# Altium project Power Board UCC28951.PrjPcb (part 3 of 4)

## Sheet Input Sense Network.SchDoc
size A4
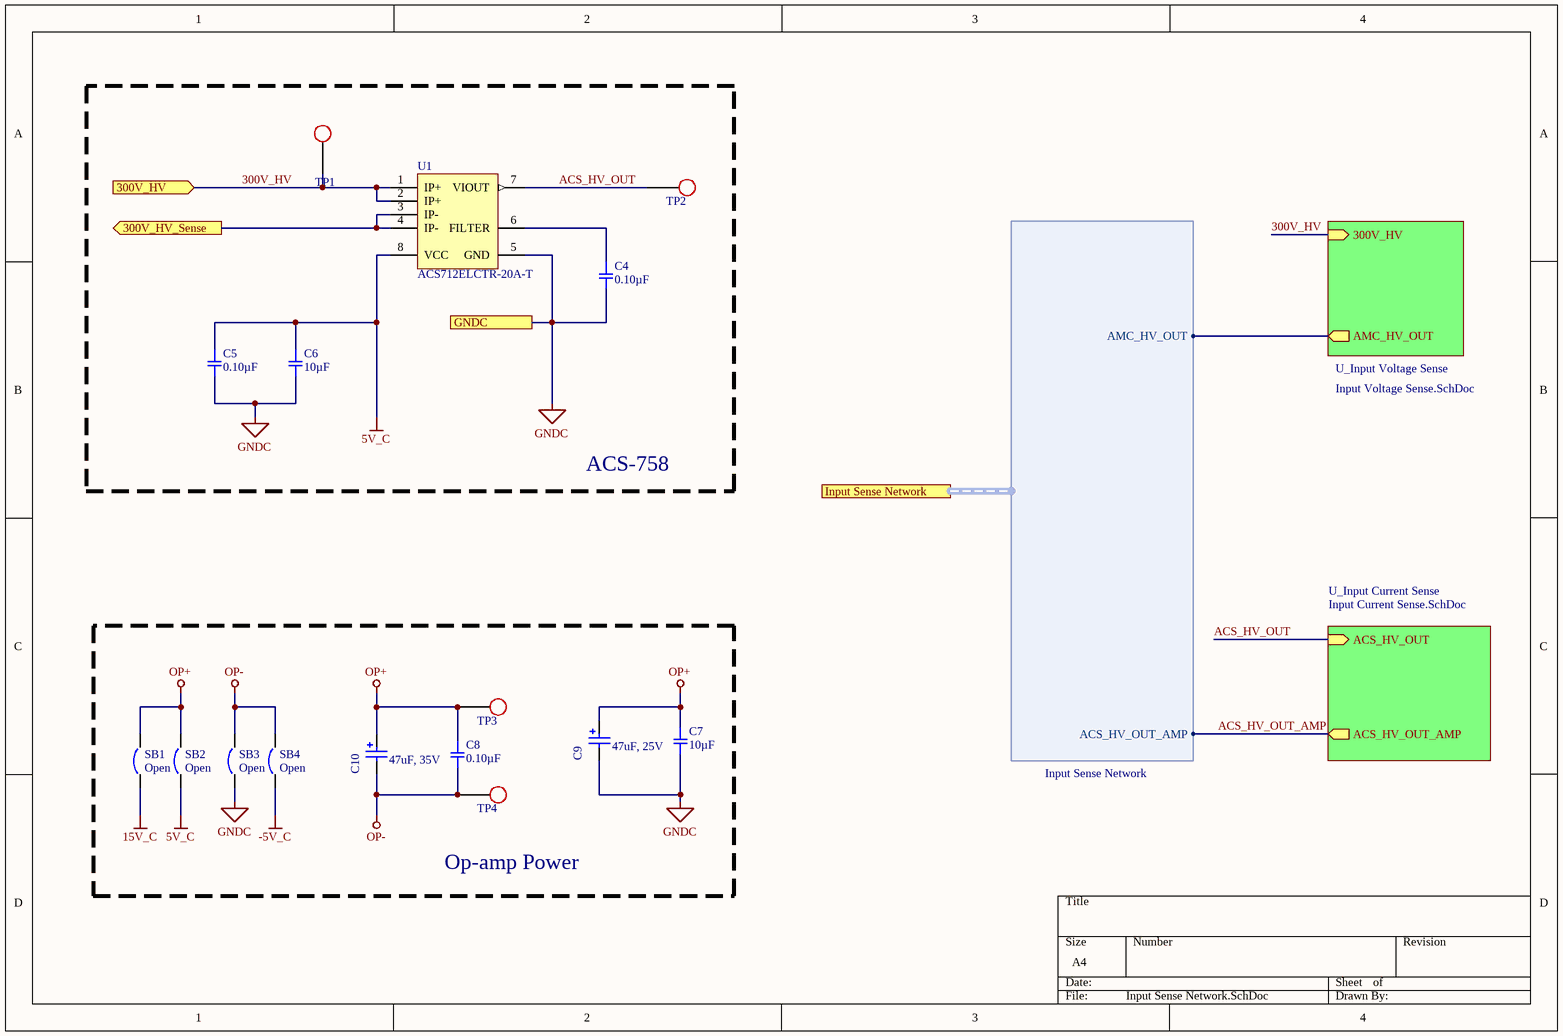
[diagram p12: Input Sense Network.SchDoc]

### Parts
C4  0.10µF  [SMD-0805C]
C5  0.10µF  [SMD-0805C]
C6  10µF  [SMD-0805C]
C7  10µF  [SMD-0805C]
C8  0.10µF  [SMD-0805C]
C9  47uF, 25V  [WCAP-ASLU_6.3x7.7]
C10  47uF, 35V  [WCAP-ASLL_6.3x5.5]
SB1  Open  [0805-Solder Bridge]  (no BOM)
SB2  Open  [0805-Solder Bridge]  (no BOM)
SB3  Open  [0805-Solder Bridge]  (no BOM)
SB4  Open  [0805-Solder Bridge]  (no BOM)
TP1  Test Point  [Test_point_THT]  (value not drawn)  (no BOM)
TP2  Test Point  [Test_point_THT]  (value not drawn)  (no BOM)
TP3  Test Point  [Test_point_THT]  (value not drawn)  (no BOM)
TP4  Test Point  [Test_point_THT]  (value not drawn)  (no BOM)
U1  ACS712ELCTR-20A-T  [SOIC127P570X175_HS-9N]

### Blocks framed on the sheet
ACS-758: C4-C6 TP1 TP2 U1
Op-amp Power: C7-C10 SB1-SB4 TP3 TP4

### Sub-sheets
U_Input Current Sense = Input Current Sense.SchDoc: ACS_HV_OUT (in), ACS_HV_OUT_AMP (out)
U_Input Voltage Sense = Input Voltage Sense.SchDoc: 300V_HV (in), AMC_HV_OUT (out)

### Ports
300V_HV (in), 300V_HV_Sense (out), GNDC, Input Sense Network (harness Input Sense Network)

### Harnesses
Input Sense Network: ACS_HV_OUT_AMP, AMC_HV_OUT

### Nets
5V_C: C5.1 C6.1 SB2.1 U1.8(VCC)
15V_C: SB1.1
-5V_C: SB4.1
GNDC: C4.2 C5.2 C6.2 C7.2 C9.1(N) SB3.1 U1.5(GND) ; port GNDC  [project net GND_LV]
OP+: C7.1 C8.1 C9.2(P) C10.2(P) SB1.2 SB2.2 TP3.1
OP-: C8.2 C10.1(N) SB3.2 SB4.2 TP4.1
300V_HV: TP1.1 U1.1(IP+) U1.2(IP+) ; port 300V_HV, sheet U_Input Voltage Sense/300V_HV
300V_HV_Sense: U1.3(IP-) U1.4(IP-) ; port 300V_HV_Sense
ACS_HV_OUT: TP2.1 U1.7(VIOUT) ; sheet U_Input Current Sense/ACS_HV_OUT
ACS_HV_OUT_AMP: sheet U_Input Current Sense/ACS_HV_OUT_AMP, port Input Sense Network.ACS_HV_OUT_AMP
AMC_HV_OUT: sheet U_Input Voltage Sense/AMC_HV_OUT, port Input Sense Network.AMC_HV_OUT
NetC4_1: C4.1 U1.6(FILTER)

### Library data of the parts
C4 C5 C8 = GCD21BR71H104KA01L: CAP CER 0.1UF 50V X7R 0805; Manufacturer: Murata Electronics North America; Factory Stock: 0; Unit Price (USD): 0.24; Minimum Quantity: 1; Tolerance: ±10%; Datasheets: http://www.murata.com/~/media/webrenewal/support/library/catalog/products/capacitor/mlcc/c03e.ashx; Image: //media.digikey.com/Renders/Murata%20Renders/0805%28GxM6%29.jpg; Digi-Key Part Number: 490-11955-1-ND; Part Number: GCD21BR71H104KA01L; Quantity Available: 157; @ qty: 0; Packaging: Cut Tape (CT); Series: GCD; Part Status: Active; Value: 0.10µF; Voltage: 50V; Temperature Coefficient: X7R; Operating Temperature: -55°C ~ 125°C; Features: -; Ratings: AEC-Q200; Applications: Automotive; Mounting Type: Surface Mount, MLCC; Package / Case: 0805 (2012 Metric); Size / Dimension: 0.079" L x 0.049" W (2.00mm x 1.25mm); Height - Seated (Max): -; Thickness (Max): 0.049" (1.25mm); Lead Spacing: -; Lead Style: -
C6 C7 = GCJ21BR71A106KE01L: CAP CER 10UF 10V X7R 0805; Manufacturer: Murata Electronics North America; Factory Stock: 0; Unit Price (USD): 0.56; Minimum Quantity: 1; Tolerance: ±10%; Datasheets: http://www.murata.com/~/media/webrenewal/support/library/catalog/products/capacitor/mlcc/c03e.ashx; Image: //media.digikey.com/Renders/Murata%20Renders/0805%20(2012%20Metric)%20.85mm.jpg; Digi-Key Part Number: 490-12646-1-ND; Part Number: GCJ21BR71A106KE01L; Quantity Available: 2702; @ qty: 0; Packaging: Cut Tape (CT); Series: GCJ; Part Status: Active; Value: 10µF; Voltage: 10V; Temperature Coefficient: X7R; Operating Temperature: -55°C ~ 125°C; Features: Soft Termination; Ratings: AEC-Q200; Applications: Automotive, Boardflex Sensitive; Mounting Type: Surface Mount, MLCC; Package / Case: 0805 (2012 Metric); Size / Dimension: 0.079" L x 0.049" W (2.00mm x 1.25mm); Height - Seated (Max): -; Thickness (Max): 0.057" (1.45mm); Lead Spacing: -; Lead Style: -
C9 = 865090445006: WCAP-ASLU Aluminium Electrolytic Capacitors, D6.3mm x L7.7mm, 47uF, +/-20%, 25VDC; Dissipation Factor: 16%; Leakage Current: 2.35uA; Endurance: 1000h; Technical Reference: ASBD077470M025DVCTCA000; Ripple Current max.: 65mA; ComponentLink1Description: Manufacturer; ComponentLink1URL: http://www.we-online.de; ComponentLink2Description: Datasheet; ComponentLink2URL: https://katalog.we-online.com/pbs/datasheet/865090445006.pdf; Mounting Technology: SMD; Operating Temperature: -40 to +85degC; Packaging: Tape and Reel; Part Number: 865090445006; Publisher: Wurth Elektronik; Capacitance: 47uF; Diameter: 6.3mm; Length: 7.7mm; Published Date: August 2019; Rated Voltage: 25VDC; Capacitance Tolerance: +/-20%
C10 = 865060543005: WCAP-ASLL SMT Aluminum Electrolytic Capacitors, D6.3mm x L5.5mm, 47uF, +/-20%, 35VDC; Dissipation Factor: 14%; Endurance: 2000h; Leakage Current: 16.45uA; Ripple Current max.: 240mA; Technical Reference: ASED055470M035DVCTBB000; ComponentLink1Description: Manufacturer; ComponentLink1URL: http://www.we-online.de; ComponentLink2Description: Datasheet; ComponentLink2URL: https://katalog.we-online.com/pbs/datasheet/865060543005.pdf; Length: 5.5mm; Mounting Technology: SMT; Operating Temperature: -55 to +105degC; Packaging: Tape and Reel; Published Date: August 2019; Capacitance: 47uF; Diameter: 6.3mm; Part Number: 865060543005; Publisher: Wurth Elektronik; Capacitance Tolerance: +/-20%; Rated Voltage: 35VDC
SB1-SB4 = Solder Bridge: Circuit Breaker; Published: 24-Mar-1999; Revision: July-2002: Re-released for DXP Platform.; Publisher: Altium Limited
TP1-TP4 = Test Point: TP
U1 = ACS712: Linear Current Sensor IC, 4.5 to 5.5 V Supply Voltage, 10 mA Supply Current, -40 to 85 degC, 8-Pin SOIC (LC), RoHS, Tape and Reel; Manufacturer: Allegro Microsystems; CLOAD: 10 nF Max.; ICC: 10 mA; F: 80 kHz; RLOAD: 4.7 kOhm Min.; Optimized Accuracy Range: +/- 20 A; TR: 3.5 us; Sensitivity Sens: 100 mV/A Typ.; Operating Temperature Range: -40 to 85 degC; ComponentLink2URL: http://www.allegromicro.com/~/media/Files/Datasheets/ACS712-Datasheet.ashx; ComponentLink1Description: Manufacturer URL; VCC: 4.5 to 5.5 V; Mounting Technology: Surface Mount; DatasheetVersion: Rev. 15; ComponentLink2Description: Datasheet; ComponentLink1URL: http://www.allegromicro.com/; PackageDescription: 8-Pin SOIC, Body 4.9 x 3.9 mm, Pitch 1.27 mm; PackageReference: LC-8; RoHS: TRUE; Packing: Tape and Reel; PartNumber: ACS712ELCTR-20A-T

## Sheet Input Current Sense.SchDoc
size A3
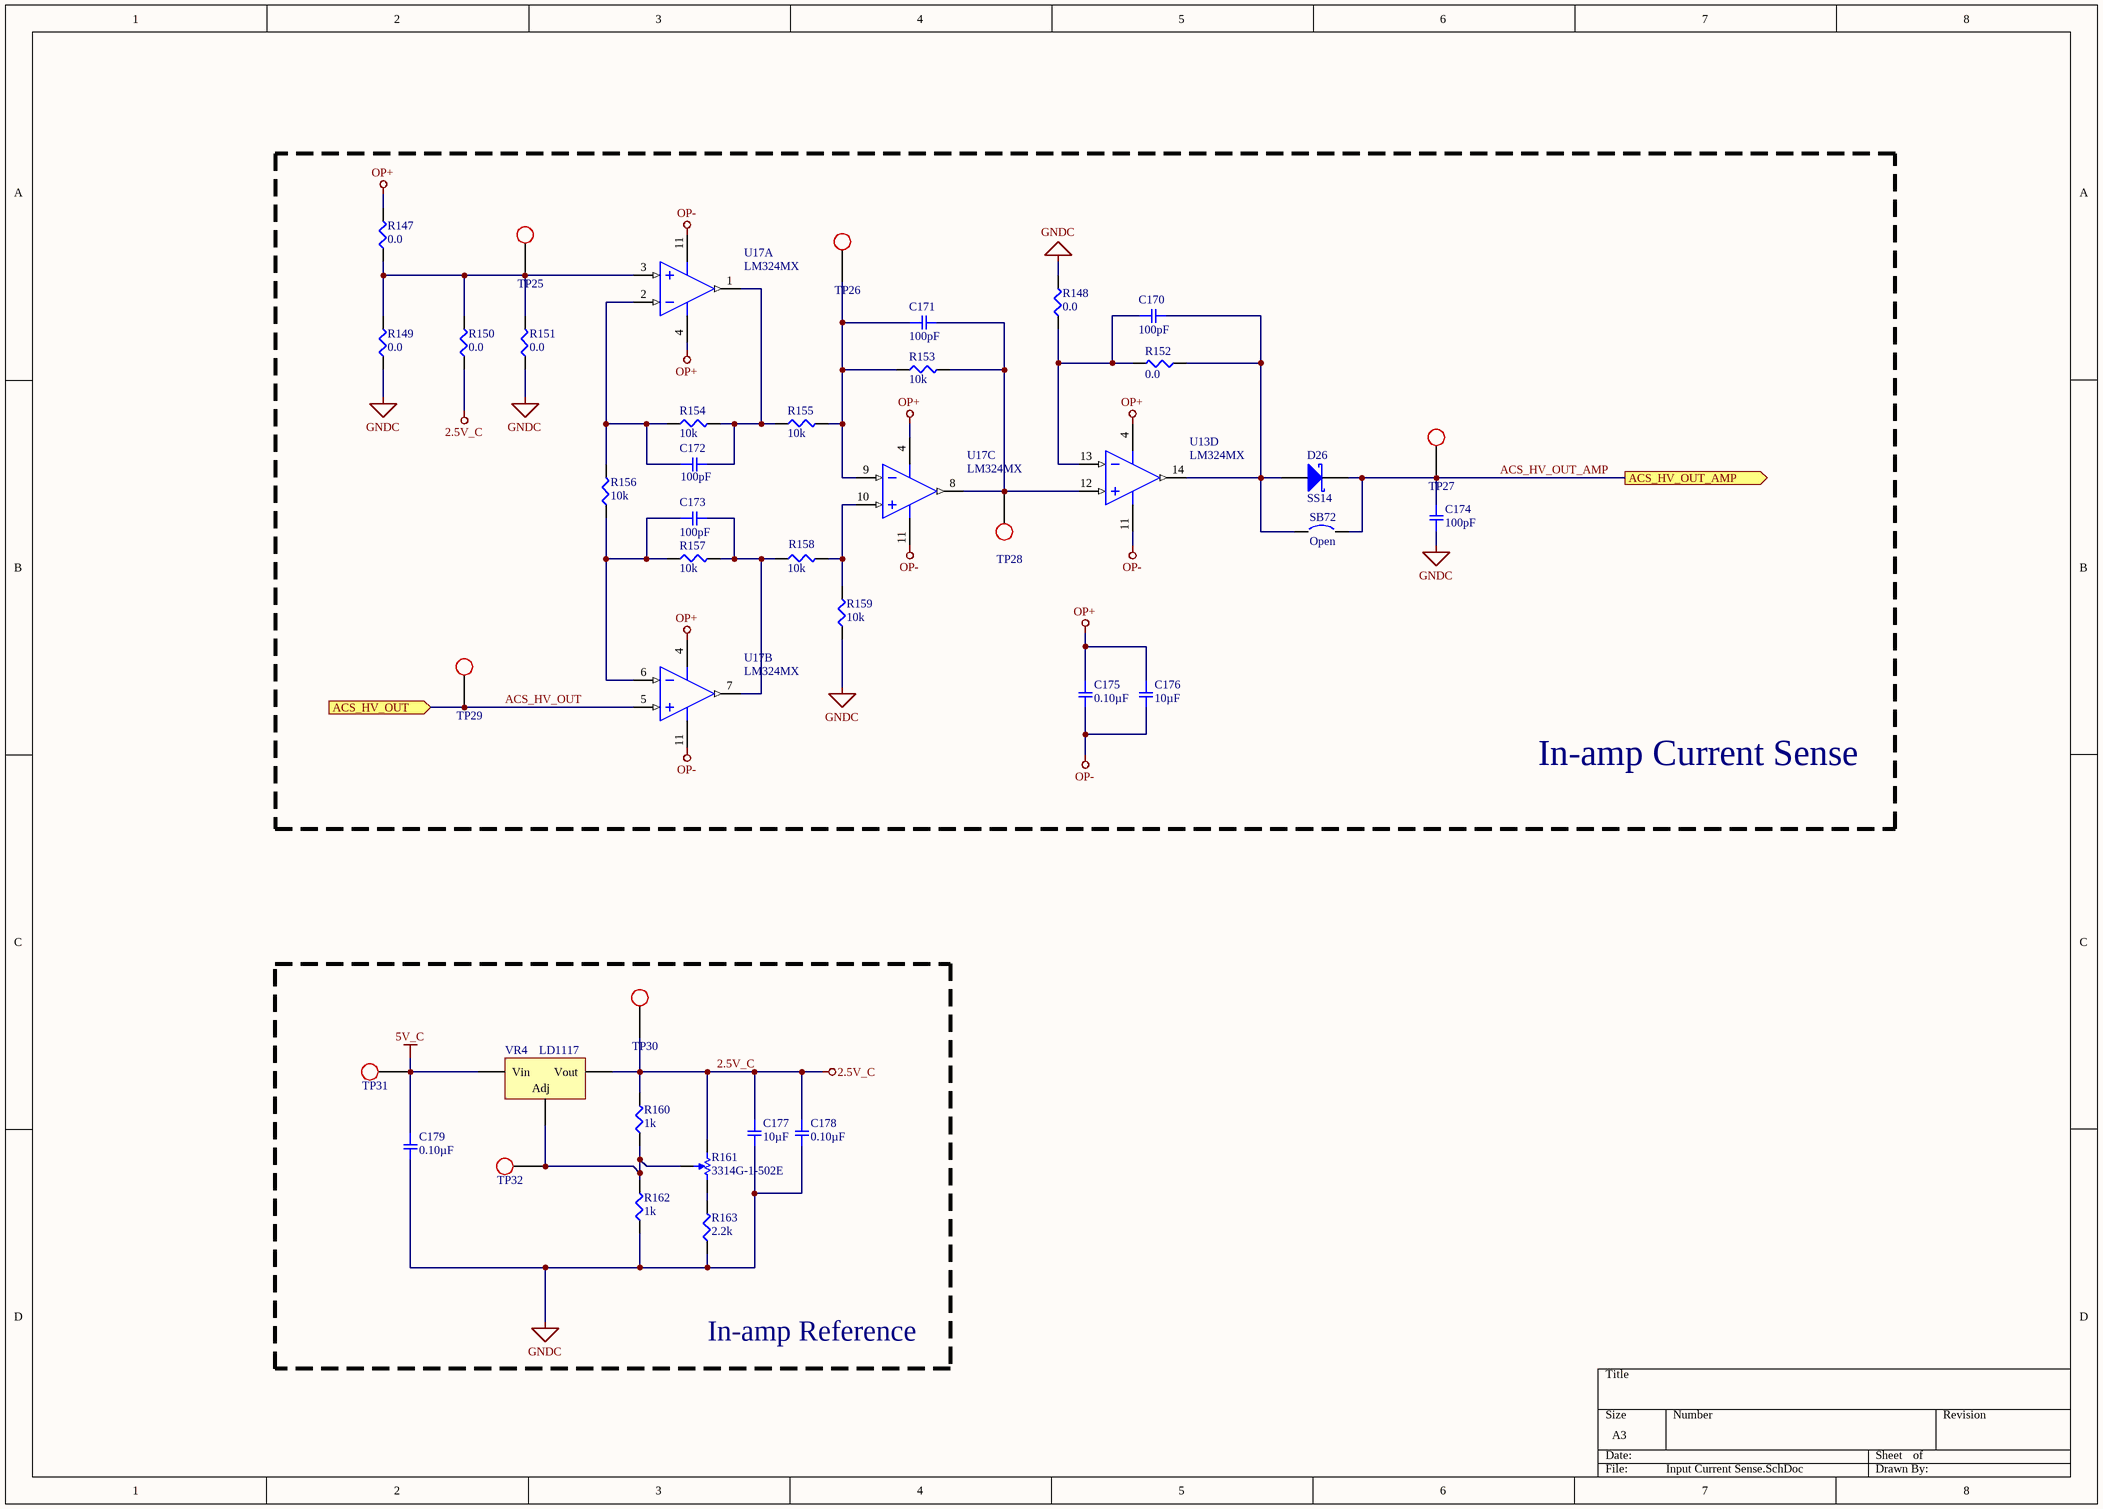
[diagram p13: Input Current Sense.SchDoc]

### Parts
(Parts that share a designator on the sheet are numbered #1, #2 ... from top to bottom, then left to right.)
C170#2  100pF  [SMD-0603C]
C171#2  100pF  [SMD-0603C]
C172#2  100pF  [SMD-0603C]
C173#2  100pF  [SMD-0603C]
C174#2  100pF  [SMD-0603C]
C175#1  0.10µF  [SMD-0805C]
C176#1  10µF  [SMD-0805C]
C177#1  10µF  [SMD-0805C]
C178#1  0.10µF  [SMD-0805C]
C179#1  0.10µF  [SMD-0805C]
D26#1  SS14  [DIOM4226X22N]
R147  0.0  [SMD-0603-RES]
R148  0.0  [SMD-0603-RES]
R149  0.0  [SMD-0603-RES]
R150  0.0  [SMD-0603-RES]
R151  0.0  [SMD-0603-RES]
R152  0.0  [SMD-0603-RES]
R153  10k  [SMD-0603-RES]
R154  10k  [SMD-0603-RES]
R155  10k  [SMD-0603-RES]
R156#2  10k  [SMD-0603-RES]
R157#2  10k  [SMD-0603-RES]
R158#2  10k  [SMD-0603-RES]
R159#2  10k  [SMD-0603-RES]
R160#2  1k  [SMD-0603-RES]
R161#2  3314G-1-502E  [BOUR-3314G-1_V]
R162#2  1k  [SMD-0603-RES]
R163#2  2.2k  [SMD-0603-RES]
SB72  Open  [0805-Solder Bridge]  (no BOM)
TP25  Test Point  [Test_point_THT]  (value not drawn)  (no BOM)
TP26  Test Point  [Test_point_THT]  (value not drawn)  (no BOM)
TP27  Test Point  [Test_point_THT]  (value not drawn)  (no BOM)
TP28  Test Point  [Test_point_THT]  (value not drawn)  (no BOM)
TP29  Test Point  [Test_point_THT]  (value not drawn)  (no BOM)
TP30  Test Point  [Test_point_THT]  (value not drawn)  (no BOM)
TP31  Test Point  [Test_point_THT]  (value not drawn)  (no BOM)
TP32  Test Point  [Test_point_THT]  (value not drawn)  (no BOM)
U13  LM324MX  [D0014A_L]  (part D of 4)
U17#1  LM324MX  [D0014A_L]  (parts A,B,C of 4)
VR4  LD1117  [SOT230P700X180-4N]

### Blocks framed on the sheet
In-amp Current Sense: C170#2 C171#2 C172#2 C173#2 C174#2 C175#1 C176#1 D26#1 R147-R155 R156#2 R157#2 R158#2 R159#2 SB72 TP25-TP29 U13 U17#1
In-amp Reference: C177#1 C178#1 C179#1 R160#2 R161#2 R162#2 R163#2 TP30-TP32 VR4

### Ports
ACS_HV_OUT (in), ACS_HV_OUT_AMP (out)

### Nets
2.5V_C: C177#1.1 C178#1.1 R150.1 R160#2.2 R161#2.1 TP30.1 VR4.2(Vout)
5V_C: C179#1.1 TP31.1 VR4.3(Vin)
GNDC: C174#2.1 C177#1.2 C178#1.2 C179#1.2 R148.2 R149.1 R151.1 R159#2.1 R162#2.1 R163#2.1  [project net GND_LV]
OP+: C175#1.1 C176#1.1 R147.2 U13.4(V+) U17#1.4(V+)
OP-: C175#1.2 C176#1.2 U13.11(GND) U17#1.11(GND)
ACS_HV_OUT: TP29.1 U17#1.5(IN2+) ; port ACS_HV_OUT
ACS_HV_OUT_AMP: C174#2.2 D26#1.1(K) SB72.2 TP27.1 ; port ACS_HV_OUT_AMP
NetC170#2_1: C170#2.1 R148.1 R152.2 U13.13(IN4-)
NetC170#2_2: C170#2.2 D26#1.2(A) R152.1 SB72.1 U13.14(OUT4)
NetC171#2_1: C171#2.1 R153.1 R155.2 TP26.1 U17#1.9(IN3-)
NetC171#2_2: C171#2.2 R153.2 TP28.1 U13.12(IN4+) U17#1.8(OUT3)
NetC172#2_1: C172#2.1 R154.1 R156#2.2 U17#1.2(IN1-)
NetC172#2_2: C172#2.2 R154.2 R155.1 U17#1.1(OUT1)
NetC173#2_1: C173#2.1 R156#2.1 R157#2.1 U17#1.6(IN2-)
NetC173#2_2: C173#2.2 R157#2.2 R158#2.1 U17#1.7(OUT2)
NetR147_1: R147.1 R149.2 R150.2 R151.2 TP25.1 U17#1.3(IN1+)
NetR158#2_2: R158#2.2 R159#2.2 U17#1.10(IN3+)
NetR160#2_1: R160#2.1 R161#2.2 R162#2.2 TP32.1 VR4.1(Adj)
NetR161#2_3: R161#2.3 R163#2.2

### Library data of the parts
C170#2 C171#2 C172#2 C173#2 C174#2 = GCM1885C1H101JA16D: CAP CER 100PF 50V NP0 0603; Manufacturer: Murata Electronics North America; Factory Stock: 0; Unit Price (USD): 0.1; Minimum Quantity: 1; Tolerance: ±5%; Temperature Coefficient: C0G, NP0; Datasheets: http://www.murata.com/~/media/webrenewal/support/library/catalog/products/capacitor/mlcc/c03e.ashx; Image: //media.digikey.com/Renders/Murata%20Renders/0603%28GCM188%29.jpg; Digi-Key Part Number: 490-4767-1-ND; Part Number: GCM1885C1H101JA16D; Quantity Available: 85695; @ qty: 0; Packaging: Cut Tape (CT); Series: GCM; Part Status: Active; Value: 100pF; Voltage: 50V; Operating Temperature: -55°C ~ 125°C; Features: -; Ratings: AEC-Q200; Applications: Automotive; Mounting Type: Surface Mount, MLCC; Package / Case: 0603 (1608 Metric); Size / Dimension: 0.063" L x 0.031" W (1.60mm x 0.80mm); Height - Seated (Max): -; Thickness (Max): 0.035" (0.90mm); Lead Spacing: -; Lead Style: -
C175#1 C178#1 C179#1 = GCD21BR71H104KA01L: as C4 on sheet Input Sense Network; Datasheets: http://www.murata.com/~/media/webrenewal/support/library/catalog/products/capacitor/mlcc/c03e.ashx; Image: //media.digikey.com/Renders/Murata%20Renders/0805%28GxM6%29.jpg; Digi-Key Part Number: 490-11955-1-ND; Part Number: GCD21BR71H104KA01L; Quantity Available: 157; @ qty: 0; Packaging: Cut Tape (CT); Series: GCD; Part Status: Active; Value: 0.10µF; Voltage: 50V; Temperature Coefficient: X7R; Operating Temperature: -55°C ~ 125°C; Features: -; Ratings: AEC-Q200; Applications: Automotive; Mounting Type: Surface Mount, MLCC; Package / Case: 0805 (2012 Metric); Size / Dimension: 0.079" L x 0.049" W (2.00mm x 1.25mm); Height - Seated (Max): -; Thickness (Max): 0.049" (1.25mm); Lead Spacing: -; Lead Style: -
C176#1 C177#1 = GCJ21BR71A106KE01L: as C6 on sheet Input Sense Network; Datasheets: http://www.murata.com/~/media/webrenewal/support/library/catalog/products/capacitor/mlcc/c03e.ashx; Image: //media.digikey.com/Renders/Murata%20Renders/0805%20(2012%20Metric)%20.85mm.jpg; Digi-Key Part Number: 490-12646-1-ND; Part Number: GCJ21BR71A106KE01L; Quantity Available: 2702; @ qty: 0; Packaging: Cut Tape (CT); Series: GCJ; Part Status: Active; Value: 10µF; Voltage: 10V; Temperature Coefficient: X7R; Operating Temperature: -55°C ~ 125°C; Features: Soft Termination; Ratings: AEC-Q200; Applications: Automotive, Boardflex Sensitive; Mounting Type: Surface Mount, MLCC; Package / Case: 0805 (2012 Metric); Size / Dimension: 0.079" L x 0.049" W (2.00mm x 1.25mm); Height - Seated (Max): -; Thickness (Max): 0.057" (1.45mm); Lead Spacing: -; Lead Style: -
D26#1 = SS14: Schottky Rectifier, 1.1 W, -65 to 125 degC, 2-Pin SMD, RoHS, Tape and Reel; Manufacturer: Fairchild; Configuration: SINGLE; Diode Element Material: SILICON; Power Dissipation Limit-Max (W): 1.1; Additional Feature: FREEWHEELINGDIODE; Signal Diode Type: SIGNALDIODE; Number of Elements: 1; JEDEC-95 Code: DO-214AC; Rep Pk Reverse Voltage-Max (V): 40; Package Body Material: PLASTIC/EPOXY; CAGE Code: 1HBD3,07933,59621,7D893; Peak Reflow Temperature (Cel): 260; Package Shape: RECTANGULAR; Manufacturer URL: https://www.fairchildsemi.com/; JESD-97 Code: e3; Package Reference: DO-214AC-2; RoHS Compliant: YES; Package Description: 2-Pin Surface Mount Device, Body 4.375 x 2.725 mm; Technology: SCHOTTKY; Surface Mount: YES; Datasheet URL: http://www.onlinecomponents.com/datasheet/ss14.aspx?p=11369800; Terminal Form: CBEND; Package Style: SMALLOUTLINE; Number of Terminals: 2; JESD-30 Code: R-PDSO-C2; Average Forward Current-Max (A): 1; Terminal Finish: MATTETIN; Datasheet Version: Oct-13; Terminal Position: DUAL; Package URL: https://www.fairchildsemi.com/package-drawings/DO/DO214AC.pdf; Moisture Sensitivity Level: 1; Lead Free: YES
R147-R152 = ERJ-3GEY0R00V: RES SMD 0.0OHM JUMPER 1/10W 0603; Manufacturer: Panasonic Electronic Components; Factory Stock: 0; Unit Price (USD): 0.00352; @ qty: 1500; Minimum Quantity: 1; Power (Watts): 0.1W, 1/10W; Part Number: ERJ-3GEY0R00V; Datasheets: http://industrial.panasonic.com/www-cgi/jvcr13pz.cgi?E+PZ+3+AOA0001+ERJ3GEY0R00V+7+WW; Image: //media.digikey.com/Photos/Panasonic%20Photos/MFG_ERJ-P6W%20Series.jpg; Digi-Key Part Number: P0.0GCT-ND; Quantity Available: 4813372; Packaging: Cut Tape (CT); Series: ERJ; Part Status: Active; Value: 0.0; Tolerance: Jumper; Composition: Thick Film; Features: Automotive AEC-Q200; Temperature Coefficient: -; Operating Temperature: -55°C ~ 155°C; Package / Case: 0603 (1608 Metric); Supplier Device Package: 0603; Size / Dimension: 0.063" L x 0.031" W (1.60mm x 0.80mm); Height - Seated (Max): 0.022" (0.55mm); Number of Terminations: 2; Failure Rate: -
R153-R155 R156#2 R157#2 R158#2 R159#2 = ERJ-3EKF1002V: RES SMD 10K OHM 1% 1/10W 0603; Manufacturer: Panasonic Electronic Components; Factory Stock: 0; Unit Price (USD): 0.00379; @ qty: 1500; Minimum Quantity: 1; Power (Watts): 0.1W, 1/10W; Temperature Coefficient: ±100ppm/°C; Part Number: ERJ-3EKF1002V; Datasheets: http://industrial.panasonic.com/www-cgi/jvcr13pz.cgi?E+PZ+3+AOA0002+ERJ3EKF1002V+7+WW; Image: //media.digikey.com/Photos/Panasonic%20Photos/MFG_ERJ-P6W%20Series.jpg; Digi-Key Part Number: P10.0KHCT-ND; Quantity Available: 6703141; Packaging: Cut Tape (CT); Series: ERJ; Part Status: Active; Value: 10k; Tolerance: ±1%; Composition: Thick Film; Features: Automotive AEC-Q200; Operating Temperature: -55°C ~ 155°C; Package / Case: 0603 (1608 Metric); Supplier Device Package: 0603; Size / Dimension: 0.063" L x 0.031" W (1.60mm x 0.80mm); Height - Seated (Max): 0.022" (0.55mm); Number of Terminations: 2; Failure Rate: -
R160#2 R162#2 = ERJ-3EKF1001V: RES SMD 1K OHM 1% 1/10W 0603; Manufacturer: Panasonic Electronic Components; Factory Stock: 0; Unit Price (USD): 0.00379; @ qty: 1500; Minimum Quantity: 1; Power (Watts): 0.1W, 1/10W; Temperature Coefficient: ±100ppm/°C; Part Number: ERJ-3EKF1001V; Datasheets: http://industrial.panasonic.com/www-cgi/jvcr13pz.cgi?E+PZ+3+AOA0002+ERJ3EKF1001V+7+WW; Image: //media.digikey.com/Photos/Panasonic%20Photos/MFG_ERJ-P6W%20Series.jpg; Digi-Key Part Number: P1.00KHCT-ND; Quantity Available: 5218845; Packaging: Cut Tape (CT); Series: ERJ; Part Status: Active; Value: 1k; Tolerance: ±1%; Composition: Thick Film; Features: Automotive AEC-Q200; Operating Temperature: -55°C ~ 155°C; Package / Case: 0603 (1608 Metric); Supplier Device Package: 0603; Size / Dimension: 0.063" L x 0.031" W (1.60mm x 0.80mm); Height - Seated (Max): 0.022" (0.55mm); Number of Terminations: 2; Failure Rate: -
R161#2 = CMP-2000-05589-1: 4 mm Square Trimpot(R) Trimming Potentiometer, 5 KOhm, +/- 20%, 0.25 W, -55 to 125 degC, 3-Pin SMD, RoHS, Tape and Reel; Manufacturer: Bourns; Power: 250; Angle of rotation: 240°; Dielectric strength: 500; Resistance: 5; Curve: linear; Package Description: 3-Pin Surface Mount Device, Body 4.5 x 4.5 mm, Pitch 1.15 mm; Package Reference: 3314G-1; Mounting Technology: SurfaceMount; Datasheet URL: http://www.bourns.com/docs/Product-Datasheets/3314.pdf; Datasheet Version: 05/2016; Tolerance: ±20%; Manufacturer URL: http://www.bourns.com/; Temperature range: -55...+125°C; Package: GullWing
R163#2 = ERJ-3EKF2201V: RES SMD 2.2K OHM 1% 1/10W 0603; Manufacturer: Panasonic Electronic Components; Factory Stock: 0; Unit Price (USD): 0.00379; @ qty: 1500; Minimum Quantity: 1; Power (Watts): 0.1W, 1/10W; Temperature Coefficient: ±100ppm/°C; Part Number: ERJ-3EKF2201V; Datasheets: http://industrial.panasonic.com/www-cgi/jvcr13pz.cgi?E+PZ+3+AOA0002+ERJ3EKF2201V+7+WW; Image: //media.digikey.com/Photos/Panasonic%20Photos/MFG_ERJ-P6W%20Series.jpg; Digi-Key Part Number: P2.20KHCT-ND; Quantity Available: 370956; Packaging: Cut Tape (CT); Series: ERJ; Part Status: Active; Value: 2.2k; Tolerance: ±1%; Composition: Thick Film; Features: Automotive AEC-Q200; Operating Temperature: -55°C ~ 155°C; Package / Case: 0603 (1608 Metric); Supplier Device Package: 0603; Size / Dimension: 0.063" L x 0.031" W (1.60mm x 0.80mm); Height - Seated (Max): 0.022" (0.55mm); Number of Terminations: 2; Failure Rate: -
SB72 = Solder Bridge: Circuit Breaker; Published: 24-Mar-1999; Revision: July-2002: Re-released for DXP Platform.; Publisher: Altium Limited
TP25-TP32 = Test Point: TP
U13 U17#1 = CMP-0055-00741-3: Low Power Quad Operational Amplifier, 14-pin Narrow SOIC; Manufacturer: Texas Instruments; PowerWise: N; CompType: Amplifiers; PackageTopMarking: NSUZXYTTE#*LM324M; Package Reference: D0014A; ComponentLink1URL: http://www.ti.com/general/docs/lit/getliterature.tsp?genericPartNumber=LM324-N&fileType=pdf; PinCount: 14; PackageDescription: Molded Package S.O., .150in Wide, 14 Lead; Code_JEDEC: MS-012AB; Code_IPC: SOIC127P600-14; ComponentLink1Description: Datasheet URL; RoHS: N
VR4 = LD117-Adj: Voltage Regulator; Published: 24-Mar-1999; LatestRevisionDate: 29-May-2009; LatestRevisionNote: IPC-7351 Footprint Added.; PackageReference: D2PAK; Publisher: Altium Limited; PackageDescription: 3-Pin Transistor Outline Package 2.54 mm Pitch, 15.1 mm Lead Span

## Sheet Input Voltage Sense.SchDoc
size A3
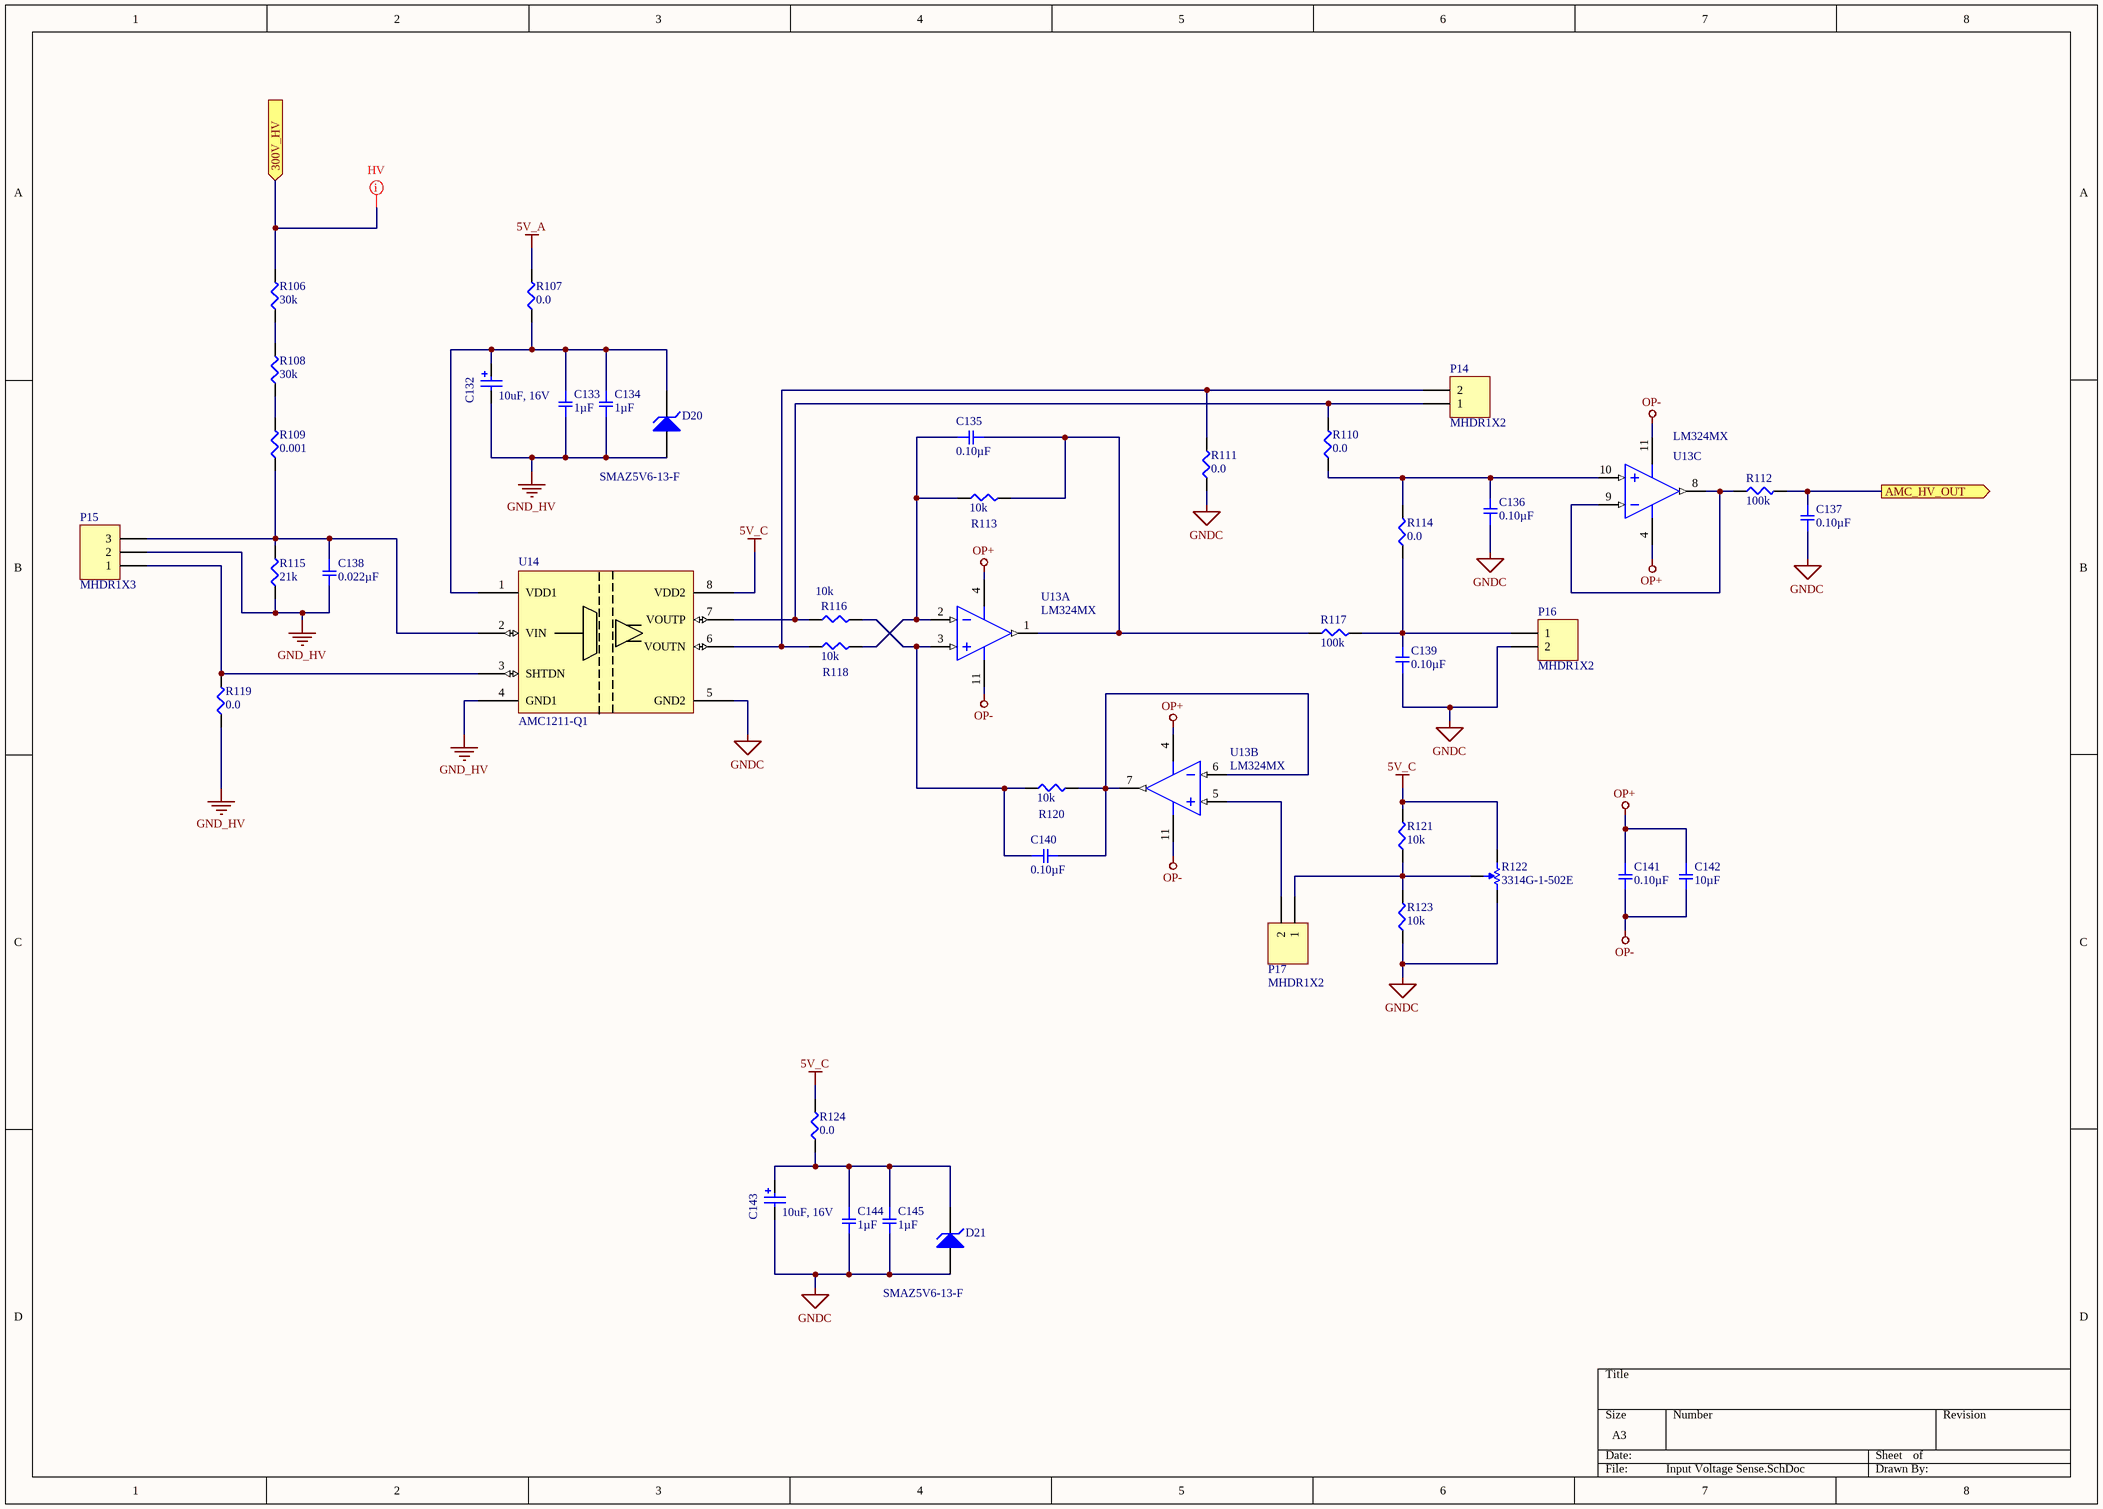
[diagram p14: Input Voltage Sense.SchDoc]

### Parts
(Parts that share a designator on the sheet are numbered #1, #2 ... from top to bottom, then left to right.)
C132  10uF, 16V  [WCAP-ASLU_3x5.5]
C133  1µF  [SMD-0805C]
C134  1µF  [SMD-0805C]
C135  0.10µF  [SMD-0603C]
C136  0.10µF  [SMD-0603C]
C137  0.10µF  [SMD-0603C]
C138  0.022µF  [SMD-1206C]
C139  0.10µF  [SMD-0603C]
C140  0.10µF  [SMD-0603C]
C141  0.10µF  [SMD-0805C]
C142  10µF  [SMD-0805C]
C143  10uF, 16V  [WCAP-ASLU_3x5.5]
C144  1µF  [SMD-0805C]
C145#1  1µF  [SMD-0805C]
D20  SMAZ5V6-13-F  [DIOD-SMA-2_V]
D21  SMAZ5V6-13-F  [DIOD-SMA-2_V]
P14#2  MHDR1X2  [MHDR1X2]
P15#1  MHDR1X3  [MHDR1X3]
P16#1  MHDR1X2  [MHDR1X2]
P17  MHDR1X2  [MHDR1X2]
R106  30k  [SMD-2512-RES]
R107  0.0  [SMD-1206-RES]
R108  30k  [SMD-2512-RES]
R109  0.001  [SMD-2512-RES]
R110  0.0  [SMD-0603-RES]
R111  0.0  [SMD-0603-RES]
R112  100k  [SMD-0603-RES]
R113  10k  [SMD-0603-RES]
R114  0.0  [SMD-0603-RES]
R115  21k  [SMD-1206-RES]
R116  10k  [SMD-0603-RES]
R117  100k  [SMD-0603-RES]
R118  10k  [SMD-0603-RES]
R119  0.0  [SMD-1206-RES]
R120  10k  [SMD-0603-RES]
R121  10k  [SMD-0603-RES]
R122  3314G-1-502E  [BOUR-3314G-1_V]
R123  10k  [SMD-0603-RES]
R124  0.0  [SMD-1206-RES]
U13  LM324MX  [D0014A_L]  (parts A,B,C of 4)
U14#2  AMC1211-Q1  [SOIC127P570X175_HS-9N]

### Ports
300V_HV (in), AMC_HV_OUT (out)

### Nets
5V_A: R107.2
5V_C: R121.2 R122.1 R124.2 U14#2.8(VDD2)
GND_HV: C132.1(N) C133.2 C134.2 C138.2 D20.1(A) P15#1.2 R115.1 R119.1 U14#2.4(GND1)
GNDC: C136.1 C137.1 C139.1 C143.1(N) C144.2 C145#1.2 D21.1(A) P16#1.2 R111.1 R122.3 R123.1 U14#2.5(GND2)  [project net GND_LV]
OP+: C141.1 C142.1 U13.4(V+)
OP-: C141.2 C142.2 U13.11(GND)
300V_HV: R106.2 ; port 300V_HV
AMC_HV_OUT: C137.2 R112.2 ; port AMC_HV_OUT
NetC132_2: C132.2(P) C133.1 C134.1 D20.2(K) R107.1 U14#2.1(VDD1)
NetC135_1: C135.1 R113.1 R118.2 U13.2(IN1-)
NetC135_2: C135.2 R113.2 R117.1 U13.1(OUT1)
NetC136_2: C136.2 R110.1 R114.2 U13.10(IN3+)
NetC138_1: C138.1 P15#1.3 R109.1 R115.2 U14#2.2(VIN)
NetC139_2: C139.2 P16#1.1 R114.1 R117.2
NetC140_1: C140.1 R116.2 R120.1 U13.3(IN1+)
NetC140_2: C140.2 R120.2 U13.6(IN2-) U13.7(OUT2)
NetC143_2: C143.2(P) C144.1 C145#1.1 D21.2(K) R124.1
NetP14#2_1: P14#2.1 R110.2 R116.1 U14#2.7(VOUTP)
NetP14#2_2: P14#2.2 R111.2 R118.1 U14#2.6(VOUTN)
NetP15#1_1: P15#1.1 R119.2 U14#2.3(SHTDN)
NetP17_1: P17.1 R121.1 R122.2 R123.2
NetP17_2: P17.2 U13.5(IN2+)
NetR106_1: R106.1 R108.2
NetR108_1: R108.1 R109.2
NetR112_1: R112.1 U13.8(OUT3) U13.9(IN3-)

### Layout directives
rule Clearance Constraint [Generic clearance = 50mil, and 18 value(s) for objects]: 300V_HV

### Library data of the parts
C132 C143 = 865090368008: WCAP-ASLU Aluminium Electrolytic Capacitors, D3mm x L5.5mm, 10uF, +/-20%, 16VDC; Dissipation Factor: 18%; Leakage Current: 3uA; Endurance: 2000h; Technical Reference: ASBA055100M016DVCTAB000; Ripple Current max.: 20mA; ComponentLink1Description: Manufacturer; ComponentLink1URL: http://www.we-online.de; ComponentLink2Description: Datasheet; ComponentLink2URL: https://katalog.we-online.com/pbs/datasheet/865090368008.pdf; Mounting Technology: SMD; Operating Temperature: -40 to +85degC; Packaging: Tape and Reel; Part Number: 865090368008; Publisher: Wurth Elektronik; Capacitance: 10uF; Diameter: 3mm; Length: 5.5mm; Published Date: August 2019; Rated Voltage: 16VDC; Capacitance Tolerance: +/-20%
C133 C134 C144 C145#1 = GCM219R71C105KA37D: CAP CER 1UF 16V X7R 0805; Manufacturer: Murata Electronics North America; Factory Stock: 0; Unit Price (USD): 0.17; Minimum Quantity: 1; Tolerance: ±10%; Datasheets: http://www.murata.com/~/media/webrenewal/support/library/catalog/products/capacitor/mlcc/c03e.ashx; Image: //media.digikey.com/photos/Murata%20Photos/NCP,GCM%20SERIES%200805.jpg; Digi-Key Part Number: 490-8043-1-ND; Part Number: GCM219R71C105KA37D; Quantity Available: 11770; @ qty: 0; Packaging: Cut Tape (CT); Series: GCM; Part Status: Active; Value: 1µF; Voltage: 16V; Temperature Coefficient: X7R; Operating Temperature: -55°C ~ 125°C; Features: -; Ratings: AEC-Q200; Applications: Automotive; Mounting Type: Surface Mount, MLCC; Package / Case: 0805 (2012 Metric); Size / Dimension: 0.079" L x 0.049" W (2.00mm x 1.25mm); Height - Seated (Max): -; Thickness (Max): 0.037" (0.95mm); Lead Spacing: -; Lead Style: -
C135-C137 C139 C140 = GCJ188R72A104KA01D: CAP CER 0.1UF 100V X7R 0603; Manufacturer: Murata Electronics North America; Factory Stock: 0; Unit Price (USD): 0.23; Minimum Quantity: 1; Tolerance: ±10%; Datasheets: http://www.murata.com/~/media/webrenewal/support/library/catalog/products/capacitor/mlcc/c03e.ashx; Image: //media.digikey.com/Renders/Murata%20Renders/0603%28LQG18%29.jpg; Digi-Key Part Number: 490-13420-1-ND; Part Number: GCJ188R72A104KA01D; Quantity Available: 2728; @ qty: 0; Packaging: Cut Tape (CT); Series: GCJ; Part Status: Active; Value: 0.10µF; Voltage: 100V; Temperature Coefficient: X7R; Operating Temperature: -55°C ~ 125°C; Features: Soft Termination; Ratings: AEC-Q200; Applications: Automotive, Boardflex Sensitive; Mounting Type: Surface Mount, MLCC; Package / Case: 0603 (1608 Metric); Size / Dimension: 0.063" L x 0.031" W (1.60mm x 0.80mm); Height - Seated (Max): -; Thickness (Max): 0.035" (0.90mm); Lead Spacing: -; Lead Style: -
C138 = GCM3195C1H223JA16D: CAP CER 0.022UF 50V NP0 1206; Manufacturer: Murata Electronics North America; Factory Stock: 0; Unit Price (USD): 0.53; Minimum Quantity: 1; Tolerance: ±5%; Temperature Coefficient: C0G, NP0; Datasheets: http://www.murata.com/~/media/webrenewal/support/library/catalog/products/capacitor/mlcc/c03e.ashx; Image: //media.digikey.com/Renders/Murata%20Renders/GR331BD72E473KW01L.jpg; Digi-Key Part Number: 490-4790-1-ND; Part Number: GCM3195C1H223JA16D; Quantity Available: 10124; @ qty: 0; Packaging: Cut Tape (CT); Series: GCM; Part Status: Active; Value: 0.022µF; Voltage: 50V; Operating Temperature: -55°C ~ 125°C; Features: -; Ratings: AEC-Q200; Applications: Automotive; Mounting Type: Surface Mount, MLCC; Package / Case: 1206 (3216 Metric); Size / Dimension: 0.126" L x 0.063" W (3.20mm x 1.60mm); Height - Seated (Max): -; Thickness (Max): 0.037" (0.95mm); Lead Spacing: -; Lead Style: -
C141 = GCD21BR71H104KA01L: as C4 on sheet Input Sense Network; Datasheets: http://www.murata.com/~/media/webrenewal/support/library/catalog/products/capacitor/mlcc/c03e.ashx; Image: //media.digikey.com/Renders/Murata%20Renders/0805%28GxM6%29.jpg; Digi-Key Part Number: 490-11955-1-ND; Part Number: GCD21BR71H104KA01L; Quantity Available: 157; @ qty: 0; Packaging: Cut Tape (CT); Series: GCD; Part Status: Active; Value: 0.10µF; Voltage: 50V; Temperature Coefficient: X7R; Operating Temperature: -55°C ~ 125°C; Features: -; Ratings: AEC-Q200; Applications: Automotive; Mounting Type: Surface Mount, MLCC; Package / Case: 0805 (2012 Metric); Size / Dimension: 0.079" L x 0.049" W (2.00mm x 1.25mm); Height - Seated (Max): -; Thickness (Max): 0.049" (1.25mm); Lead Spacing: -; Lead Style: -
C142 = GCJ21BR71A106KE01L: as C6 on sheet Input Sense Network; Datasheets: http://www.murata.com/~/media/webrenewal/support/library/catalog/products/capacitor/mlcc/c03e.ashx; Image: //media.digikey.com/Renders/Murata%20Renders/0805%20(2012%20Metric)%20.85mm.jpg; Digi-Key Part Number: 490-12646-1-ND; Part Number: GCJ21BR71A106KE01L; Quantity Available: 2702; @ qty: 0; Packaging: Cut Tape (CT); Series: GCJ; Part Status: Active; Value: 10µF; Voltage: 10V; Temperature Coefficient: X7R; Operating Temperature: -55°C ~ 125°C; Features: Soft Termination; Ratings: AEC-Q200; Applications: Automotive, Boardflex Sensitive; Mounting Type: Surface Mount, MLCC; Package / Case: 0805 (2012 Metric); Size / Dimension: 0.079" L x 0.049" W (2.00mm x 1.25mm); Height - Seated (Max): -; Thickness (Max): 0.057" (1.45mm); Lead Spacing: -; Lead Style: -
D20 D21 = CMP-2000-07092-1: Zener Diode, 1 W, 5.6 V, -65 to 150 degC, 2-Pin SMA, RoHS, Tape and Reel; Zz - Zener Impedance: 2Ohms; Ir - Reverse Current: 5uA; Brand: DiodesIncorporated; Vz - Zener Voltage: 5.6V; Pd - Power Dissipation: 1W; Voltage Tolerance: 5%; Unit Weight: 0.002258oz; Vf - Forward Voltage: 1.2Vat200mA; Configuration: Single; Product: ZenerDiode; Zener Current: 5uA; Datasheet URL: http://www.diodes.com/_files/datasheets/ds18015.pdf; Package Reference: SMA-2; Mounting Technology: SurfaceMount; Product Category: ZenerDiodes; Factory Pack Quantity: 5000; Datasheet Version: Rev. 18-2, 04/2016; Package Description: 2-Pin Surface Mounted Assembly, Body 4.3 x 2.605 mm, Height 2.4 mm; Width: 2.92mm; Manufacturer: DiodesIncorporated; Height: 2.09mm; Length: 4.6mm; Mounting Style: SMD/SMT; Series: SMAZ5; Package / Case: SMA-2; Minimum Operating Temperature: -65C; Termination Style: SMD/SMT; Maximum Operating Temperature: +150C; RoHS: True; Manufacturer URL: http://www.diodes.com/; Packaging: Reel
P14#2 P16#1 P17 = MHDR1X2: Header, 2-Pin; LatestRevisionDate: 17-Jul-2002; LatestRevisionNote: Re-released for DXP Platform.; Publisher: Altium Limited
P15#1 = MHDR1X3: Header, 3-Pin; LatestRevisionDate: 17-Jul-2002; LatestRevisionNote: Re-released for DXP Platform.; Publisher: Altium Limited
R106 R108 = ERJ-1TYJ303U: RES SMD 30K OHM 5% 1W 2512; Manufacturer: Panasonic Electronic Components; Factory Stock: 0; Unit Price (USD): 0.07603; @ qty: 1500; Minimum Quantity: 1; Temperature Coefficient: ±200ppm/°C; Part Number: ERJ-1TYJ303U; Datasheets: //media.digikey.com/pdf/Data%20Sheets/Panasonic%20Resistors%20Thermistors%20PDFs/ERJ-xG,14,12(Z),1T_Rev_Apr_2015.pdf; Image: //media.digikey.com/Renders/Panasonic%20Renders/ERJ-2512%20Pkg.jpg; Digi-Key Part Number: PT30KXCT-ND; Quantity Available: 7362; Packaging: Cut Tape (CT); Series: ERJ; Part Status: Active; Value: 30k; Tolerance: ±5%; Power (Watts): 1W; Composition: Thick Film; Features: Automotive AEC-Q200; Operating Temperature: -55°C ~ 155°C; Package / Case: 2512 (6432 Metric); Supplier Device Package: 2512; Size / Dimension: 0.252" L x 0.126" W (6.40mm x 3.20mm); Height - Seated (Max): 0.028" (0.70mm); Number of Terminations: 2; Failure Rate: -
R107 R119 R124 = ERJ-8GEY0R00V: RES SMD 0.0 OHM JUMPER 1/4W 1206; Manufacturer: Panasonic Electronic Components; Factory Stock: 0; Unit Price (USD): 0.00768; @ qty: 1500; Minimum Quantity: 1; Power (Watts): 0.25W, 1/4W; Part Number: ERJ-8GEY0R00V; Datasheets: http://industrial.panasonic.com/www-cgi/jvcr13pz.cgi?E+PZ+3+AOA0001+ERJ8GEY0R00V+7+WW; Image: //media.digikey.com/Renders/Panasonic%20Renders/ERJ-1206%20Pkg.jpg; Digi-Key Part Number: P0.0ECT-ND; Quantity Available: 1074190; Packaging: Cut Tape (CT); Series: ERJ; Part Status: Active; Value: 0.0; Tolerance: Jumper; Composition: Thick Film; Features: Automotive AEC-Q200; Temperature Coefficient: -; Operating Temperature: -55°C ~ 155°C; Package / Case: 1206 (3216 Metric); Supplier Device Package: 1206; Size / Dimension: 0.126" L x 0.063" W (3.20mm x 1.60mm); Height - Seated (Max): 0.028" (0.70mm); Number of Terminations: 2; Failure Rate: -
R109 = ERJ-MS4SF1M0U: RES SMD 0.001 OHM 1% 3W 2512; Manufacturer: Panasonic Electronic Components; Factory Stock: 0; Unit Price (USD): 0.41555; @ qty: 1500; Minimum Quantity: 1; Temperature Coefficient: ±75ppm/°C; Part Number: ERJ-MS4SF1M0U; Datasheets: https://industrial.panasonic.com/cdbs/www-data/pdf/RDA0000/AOA0000C266.pdf; Image: //media.digikey.com/Photos/Panasonic%20Elect%20Works%20Photos/MFG_ERJ-MS4.jpg; Digi-Key Part Number: P17089CT-ND; Quantity Available: 1960; Packaging: Cut Tape (CT); Series: ERJ; Part Status: Active; Value: 0.001; Tolerance: ±1%; Power (Watts): 3W; Composition: Metal Element; Features: Automotive AEC-Q200, Current Sense, Moisture Resistant; Operating Temperature: -65°C ~ 170°C; Package / Case: 2512 (6432 Metric); Supplier Device Package: 2512; Size / Dimension: 0.252" L x 0.126" W (6.40mm x 3.20mm); Height - Seated (Max): 0.053" (1.35mm); Number of Terminations: 2; Failure Rate: -
R110 R111 R114 = ERJ-3GEY0R00V: as R147-R152 on sheet Input Current Sense; Part Number: ERJ-3GEY0R00V; Datasheets: http://industrial.panasonic.com/www-cgi/jvcr13pz.cgi?E+PZ+3+AOA0001+ERJ3GEY0R00V+7+WW; Image: //media.digikey.com/Photos/Panasonic%20Photos/MFG_ERJ-P6W%20Series.jpg; Digi-Key Part Number: P0.0GCT-ND; Quantity Available: 4813372; Packaging: Cut Tape (CT); Series: ERJ; Part Status: Active; Value: 0.0; Tolerance: Jumper; Composition: Thick Film; Features: Automotive AEC-Q200; Temperature Coefficient: -; Operating Temperature: -55°C ~ 155°C; Package / Case: 0603 (1608 Metric); Supplier Device Package: 0603; Size / Dimension: 0.063" L x 0.031" W (1.60mm x 0.80mm); Height - Seated (Max): 0.022" (0.55mm); Number of Terminations: 2; Failure Rate: -
R112 R117 = ERJ-3EKF1003V: RES SMD 100K OHM 1% 1/10W 0603; Manufacturer: Panasonic Electronic Components; Factory Stock: 0; Unit Price (USD): 0.00379; @ qty: 1500; Minimum Quantity: 1; Power (Watts): 0.1W, 1/10W; Temperature Coefficient: ±100ppm/°C; Part Number: ERJ-3EKF1003V; Datasheets: http://industrial.panasonic.com/www-cgi/jvcr13pz.cgi?E+PZ+3+AOA0002+ERJ3EKF1003V+7+WW; Image: //media.digikey.com/Photos/Panasonic%20Photos/MFG_ERJ-P6W%20Series.jpg; Digi-Key Part Number: P100KHCT-ND; Quantity Available: 2179804; Packaging: Cut Tape (CT); Series: ERJ; Part Status: Active; Value: 100k; Tolerance: ±1%; Composition: Thick Film; Features: Automotive AEC-Q200; Operating Temperature: -55°C ~ 155°C; Package / Case: 0603 (1608 Metric); Supplier Device Package: 0603; Size / Dimension: 0.063" L x 0.031" W (1.60mm x 0.80mm); Height - Seated (Max): 0.022" (0.55mm); Number of Terminations: 2; Failure Rate: -
R113 R116 R118 R120 R121 R123 = ERJ-3EKF1002V: as R153-R155 on sheet Input Current Sense; Part Number: ERJ-3EKF1002V; Datasheets: http://industrial.panasonic.com/www-cgi/jvcr13pz.cgi?E+PZ+3+AOA0002+ERJ3EKF1002V+7+WW; Image: //media.digikey.com/Photos/Panasonic%20Photos/MFG_ERJ-P6W%20Series.jpg; Digi-Key Part Number: P10.0KHCT-ND; Quantity Available: 6703141; Packaging: Cut Tape (CT); Series: ERJ; Part Status: Active; Value: 10k; Tolerance: ±1%; Composition: Thick Film; Features: Automotive AEC-Q200; Operating Temperature: -55°C ~ 155°C; Package / Case: 0603 (1608 Metric); Supplier Device Package: 0603; Size / Dimension: 0.063" L x 0.031" W (1.60mm x 0.80mm); Height - Seated (Max): 0.022" (0.55mm); Number of Terminations: 2; Failure Rate: -
R115 = ERJ-8ENF2102V: RES SMD 21K OHM 1% 1/4W 1206; Manufacturer: Panasonic Electronic Components; Factory Stock: 0; Unit Price (USD): 0.00933; @ qty: 1500; Minimum Quantity: 1; Power (Watts): 0.25W, 1/4W; Temperature Coefficient: ±100ppm/°C; Part Number: ERJ-8ENF2102V; Datasheets: http://industrial.panasonic.com/www-cgi/jvcr13pz.cgi?E+PZ+3+AOA0002+ERJ8ENF2102V+7+WW; Image: //media.digikey.com/Renders/Panasonic%20Renders/ERJ-1206%20Pkg.jpg; Digi-Key Part Number: P21.0KFCT-ND; Quantity Available: 44556; Packaging: Cut Tape (CT); Series: ERJ; Part Status: Active; Value: 21k; Tolerance: ±1%; Composition: Thick Film; Features: Automotive AEC-Q200; Operating Temperature: -55°C ~ 155°C; Package / Case: 1206 (3216 Metric); Supplier Device Package: 1206; Size / Dimension: 0.126" L x 0.063" W (3.20mm x 1.60mm); Height - Seated (Max): 0.028" (0.70mm); Number of Terminations: 2; Failure Rate: -
R122 = CMP-2000-05589-1: as R161#2 on sheet Input Current Sense; Package Description: 3-Pin Surface Mount Device, Body 4.5 x 4.5 mm, Pitch 1.15 mm; Package Reference: 3314G-1; Mounting Technology: SurfaceMount; Datasheet URL: http://www.bourns.com/docs/Product-Datasheets/3314.pdf; Datasheet Version: 05/2016; Tolerance: ±20%; Manufacturer URL: http://www.bourns.com/; Temperature range: -55...+125°C; Package: GullWing
U13 = CMP-0055-00741-3: as U13 on sheet Input Current Sense; Package Reference: D0014A; ComponentLink1URL: http://www.ti.com/general/docs/lit/getliterature.tsp?genericPartNumber=LM324-N&fileType=pdf; PinCount: 14; PackageDescription: Molded Package S.O., .150in Wide, 14 Lead; Code_JEDEC: MS-012AB; Code_IPC: SOIC127P600-14; ComponentLink1Description: Datasheet URL; RoHS: N

## Sheet Synchronous Rectification Stage.SchDoc
size A3
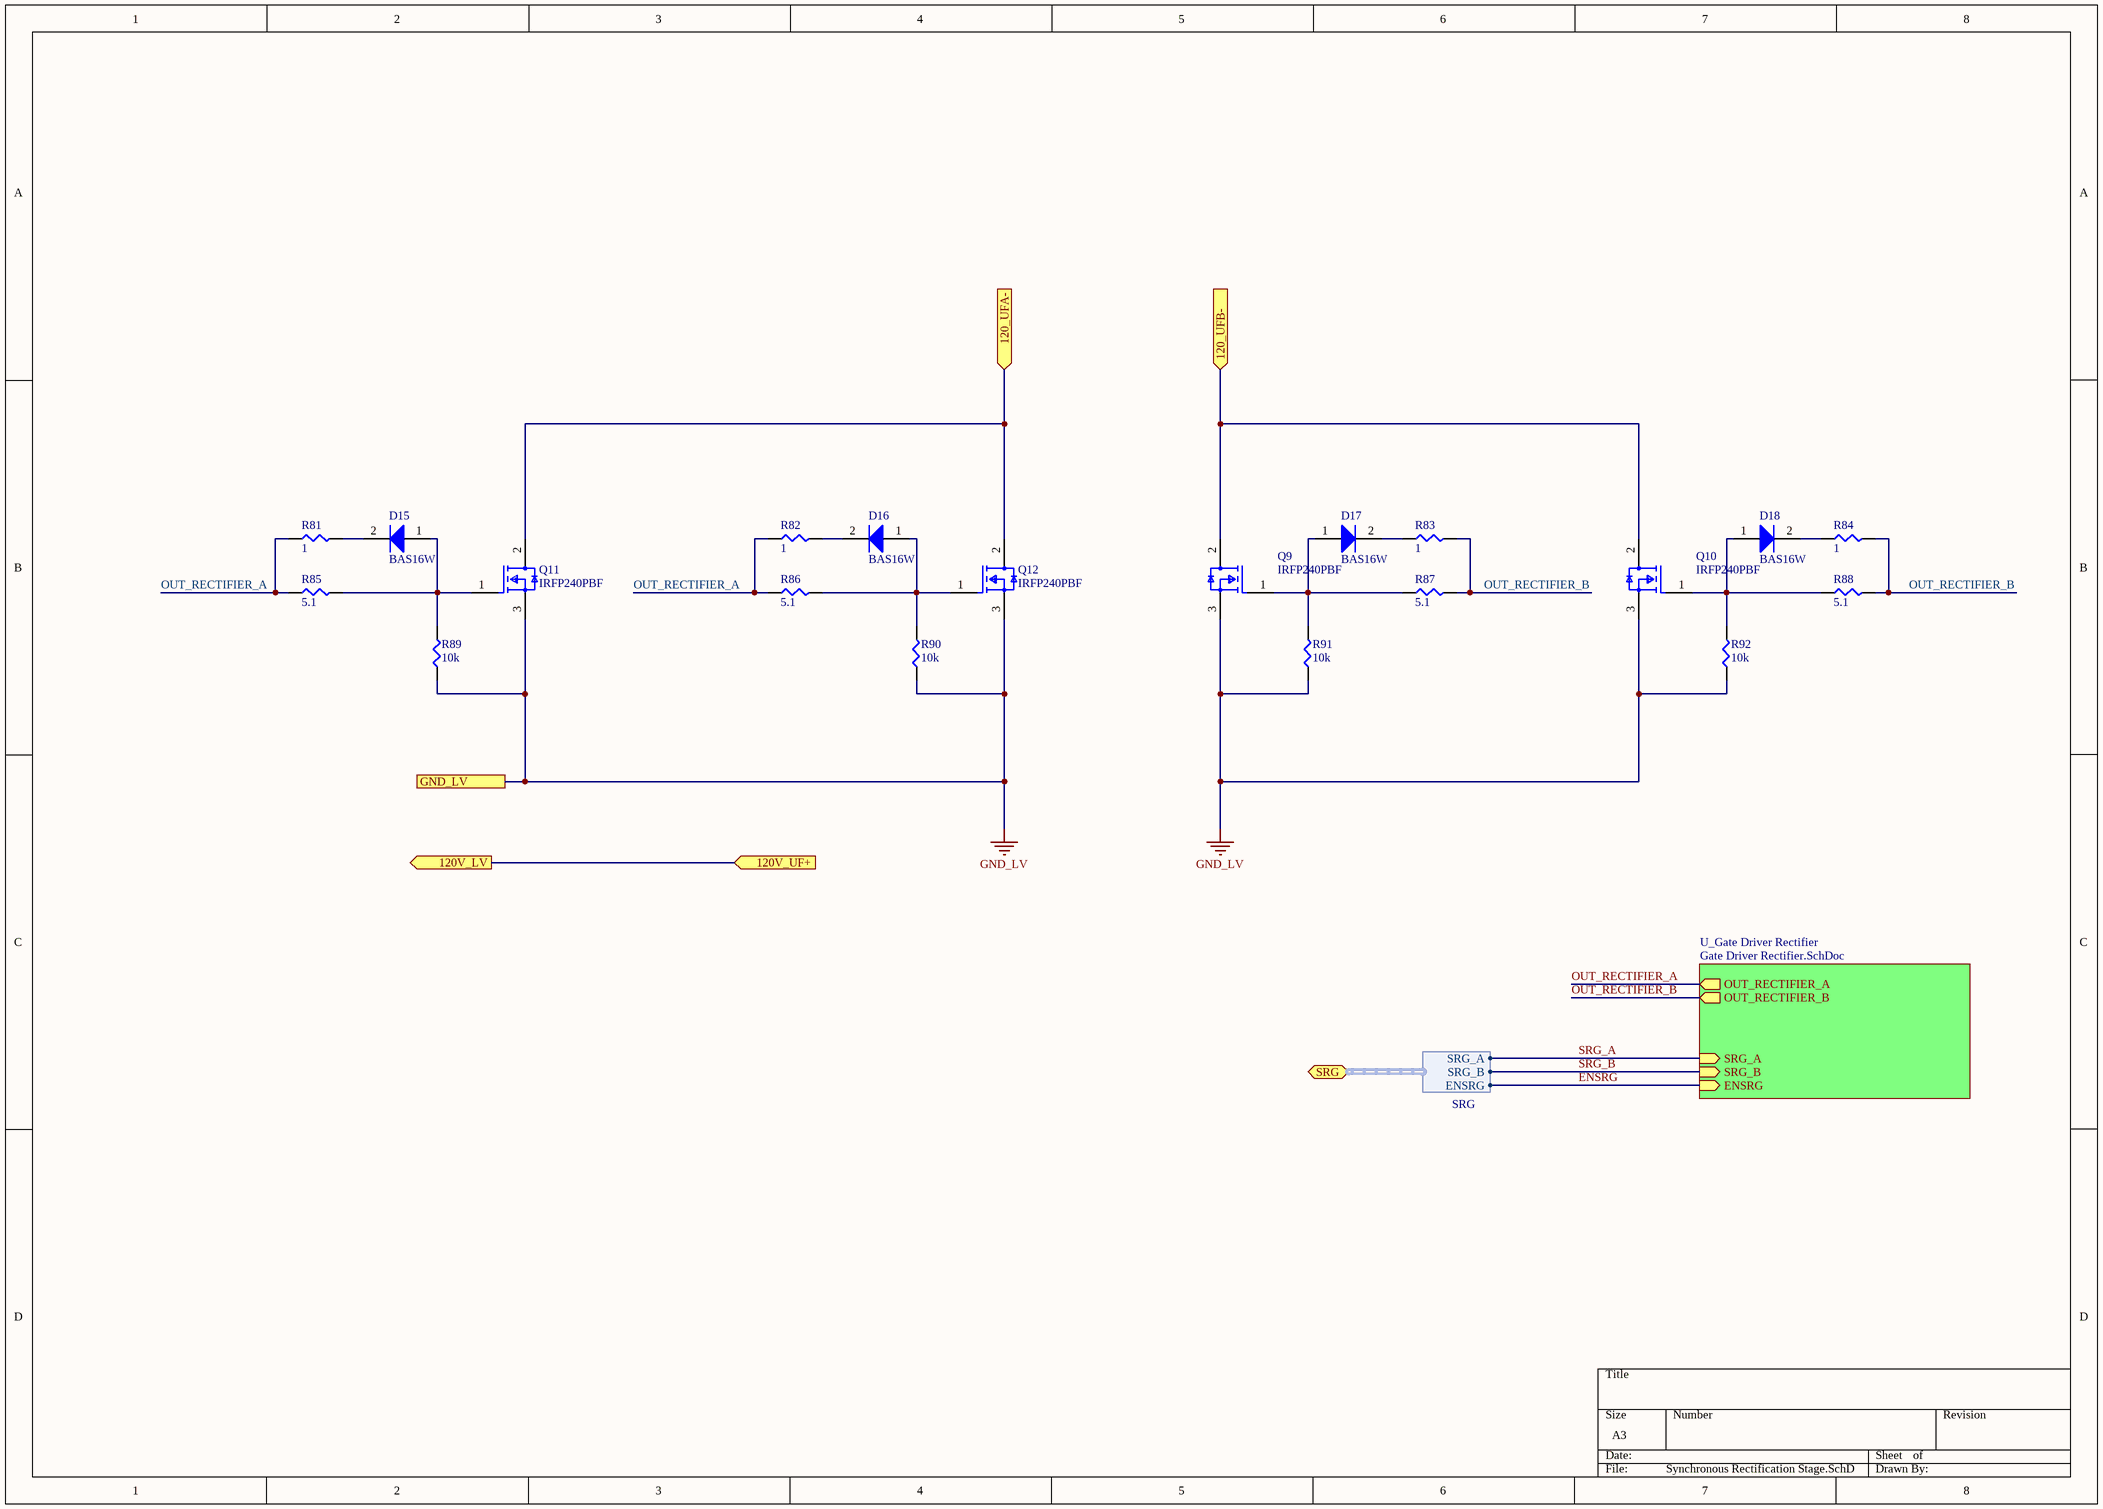
[diagram p15: Synchronous Rectification Stage.SchDoc]

### Parts
D15  BAS16W  [SODFL250X110-2N]
D16  BAS16W  [SODFL250X110-2N]
D17  BAS16W  [SODFL250X110-2N]
D18  BAS16W  [SODFL250X110-2N]
Q9  IRFP240PBF  [FP-E19-0614-MFG]
Q10  IRFP240PBF  [FP-E19-0614-MFG]
Q11  IRFP240PBF  [FP-E19-0614-MFG]
Q12  IRFP240PBF  [FP-E19-0614-MFG]
R81  1  [SMD-0805-RES]
R82  1  [SMD-0805-RES]
R83  1  [SMD-0805-RES]
R84  1  [SMD-0805-RES]
R85  5.1  [SMD-1206-RES]
R86  5.1  [SMD-1206-RES]
R87  5.1  [SMD-1206-RES]
R88  5.1  [SMD-1206-RES]
R89  10k  [SMD-1206-RES]
R90  10k  [SMD-1206-RES]
R91  10k  [SMD-1206-RES]
R92  10k  [SMD-1206-RES]

### Sub-sheets
U_Gate Driver Rectifier = Gate Driver Rectifier.SchDoc: OUT_RECTIFIER_B (out), ENSRG (in), OUT_RECTIFIER_A (out), SRG_A (in), SRG_B (in)

### Ports
120_UFA- (in), 120_UFB- (in), 120V_LV (out), 120V_UF+ (in), GND_LV, SRG (bidir, harness SRG)

### Harnesses
SRG: SRG_A, SRG_B, ENSRG

### Nets
GND_LV: Q9.3(S) Q10.3(S) Q11.3(S) Q12.3(S) R89.1 R90.1 R91.1 R92.1 ; port GND_LV
120_UFA-: Q11.2(D) Q12.2(D) ; port 120_UFA-
120_UFB-: Q9.2(D) Q10.2(D) ; port 120_UFB-
120V_LV: port 120V_LV, port 120V_UF+
ENSRG: sheet U_Gate Driver Rectifier/ENSRG, port SRG.ENSRG
OUT_RECTIFIER_A: R81.1 R82.1 R85.1 R86.1 ; sheet U_Gate Driver Rectifier/OUT_RECTIFIER_A
OUT_RECTIFIER_B: R83.2 R84.2 R87.2 R88.2 ; sheet U_Gate Driver Rectifier/OUT_RECTIFIER_B
SRG_A: sheet U_Gate Driver Rectifier/SRG_A, port SRG.SRG_A
SRG_B: sheet U_Gate Driver Rectifier/SRG_B, port SRG.SRG_B
NetD15_1: D15.1(A) Q11.1(G) R85.2 R89.2
NetD15_2: D15.2(K) R81.2
NetD16_1: D16.1(A) Q12.1(G) R86.2 R90.2
NetD16_2: D16.2(K) R82.2
NetD17_1: D17.1(A) Q9.1(G) R87.1 R91.2
NetD17_2: D17.2(K) R83.1
NetD18_1: D18.1(A) Q10.1(G) R88.1 R92.2
NetD18_2: D18.2(K) R84.1

### Library data of the parts
D15-D18 = BAS16_SOD: Silicon Switching Diode, SOT323, Reel, Green; Manufacturer: Infineon; IR (max): 100Â nA; Configuration: Single; VBR (min): 85Â V; VR (max): 80Â V; trr (max): 4Â ns; Green: TRUE; VF (max): 1.25Â V; IF (max): 250Â mA; Mounting Technology: Surface Mount; PackageReference: SOT323; ComponentLink2URL: http://www.infineon.com/dgdl/bas16series.pdf?folderId=db3a30431400ef6801141b5844e103ea&fileId=db3a30431400ef6801141b93811b03ff; Halogen-free: TRUE; ComponentLink2Description: Datasheet; PartNumber: BAS16W; ComponentLink1Description: Manufacturer URL; ComponentLink3URL: http://www.infineon.com/dgdl/SOT323-Package_Overview.pdf?folderId=db3a30431936bc4b0119533e1dcb3c92&fileId=db3a30431936bc4b011953495f283cb1; ComponentLink1URL: http://www.infineon.com/; PackageDescription: 3-Pin Small Outline Transistor Package, 1.25 x 2 mm Body, 0.65 mm Pitch; ComponentLink3Description: Package Specification
Q9-Q12 = CMP-02550-000013-1: MOSFET N-CH 200V 20A TO-247AC; Manufacturer: Vishay; Threshold Vgs: 4V; Input Capacitace At Vds: 1300pF @ 25V; Threshold Vgs Min: 2V; Reverse Recovery Time: 300ns; Pulse Drain Current: 80A; Depletion Mode: False; Power Dissipation: 150W; Number Of Channels: 1; Turn Off Delay Time: 45ns; Gate Charge At Vgs: 70nC @ 10V; Turn On Delay Time: 14ns; Reverse Recovery Charge: 3400nC; Rthja Max: 40°C/W; Gate To Source Voltage: 20V; Drain To Source Resistance: 0.18Ω; Max Junction Temp: +150°C; Standoff Height: 3.71mm; Category: Trans; Device Class L1: Discrete Semiconductors; Continuous Drain Current: 20A; Manufacturer Part Number: IRFP240PBF; Technology: MOSFET; Temperature Range Low: -55°C; Device Class L3: MOSFETs; Octopart: https://octopart.com/irfp240pbf-vishay-46527395; RoHS: TRUE; Threshold Vgs Max: 4V; Max Forward Diode Voltage: 2V; Lead Free: Yes; Mouser Description: MOSFET N-Chan 200V 20 Amp; Temperature Range High: +150°C; ComponentLink2Description: Datasheet; Number Of N Channels: 1; Height: 25.11mm; Ipc Land Pattern Name: TO-220; Temperature: -55°C to +150°C; Device Class L2: Transistors; ComponentLink2URL: http://www.vishay.com/docs/91210/91210.pdf; Package: E19-0614; Drain To Source Voltage: 200V; Digikey Description: MOSFET N-CH 200V 20A TO-247AC; Automotive: No; Drain To Source Breakdown Voltage: 200V
R81-R84 = ERJ-6BQF1R0V: RES SMD 1 OHM 1% 1/3W 0805; Manufacturer: Panasonic Electronic Components; Factory Stock: 0; Unit Price (USD): 0.05834; @ qty: 1500; Power (Watts): 0.333W, 1/3W; Temperature Coefficient: ±200ppm/°C; Part Number: ERJ-6BQF1R0V; Datasheets: https://industrial.panasonic.com/cdbs/www-data/pdf/RDA0000/AOA0000C239.pdf; Image: //media.digikey.com/Renders/Panasonic%20Renders/ERJ-0805%20Pkg.jpg; Digi-Key Part Number: P17499CT-ND; Quantity Available: 808; Minimum Quantity: 1; Packaging: Cut Tape (CT); Series: ERJ; Part Status: Active; Value: 1; Tolerance: ±1%; Composition: Thick Film; Features: Automotive AEC-Q200, Current Sense; Operating Temperature: -55°C ~ 125°C; Package / Case: 0805 (2012 Metric); Supplier Device Package: 0805; Size / Dimension: 0.079" L x 0.049" W (2.00mm x 1.25mm); Height - Seated (Max): 0.028" (0.70mm); Number of Terminations: 2; Failure Rate: -
R85-R88 = ERJ-8BQF5R1V: RES SMD 5.1 OHM 1% 1/2W 1206; Manufacturer: Panasonic Electronic Components; Factory Stock: 0; Unit Price (USD): 0.05778; @ qty: 1500; Minimum Quantity: 1; Power (Watts): 0.5W, 1/2W; Temperature Coefficient: ±200ppm/°C; Part Number: ERJ-8BQF5R1V; Datasheets: https://industrial.panasonic.com/cdbs/www-data/pdf/RDA0000/AOA0000C239.pdf; Image: //media.digikey.com/Renders/Panasonic%20Renders/ERJ-1206%20Pkg.jpg; Digi-Key Part Number: P17617CT-ND; Quantity Available: 4802; Packaging: Cut Tape (CT); Series: ERJ; Part Status: Active; Value: 5.1; Tolerance: ±1%; Composition: Thick Film; Features: Automotive AEC-Q200, Current Sense; Operating Temperature: -55°C ~ 125°C; Package / Case: 1206 (3216 Metric); Supplier Device Package: 1206; Size / Dimension: 0.126" L x 0.063" W (3.20mm x 1.60mm); Height - Seated (Max): 0.028" (0.70mm); Number of Terminations: 2; Failure Rate: -
R89-R92 = ERJ-8ENF1002V: RES SMD 10K OHM 1% 1/4W 1206; Manufacturer: Panasonic Electronic Components; Factory Stock: 0; Unit Price (USD): 0.00933; @ qty: 1500; Minimum Quantity: 1; Power (Watts): 0.25W, 1/4W; Temperature Coefficient: ±100ppm/°C; Part Number: ERJ-8ENF1002V; Datasheets: http://industrial.panasonic.com/www-cgi/jvcr13pz.cgi?E+PZ+3+AOA0002+ERJ8ENF1002V+7+WW; Image: //media.digikey.com/Renders/Panasonic%20Renders/ERJ-1206%20Pkg.jpg; Digi-Key Part Number: P10.0KFCT-ND; Quantity Available: 1108398; Packaging: Cut Tape (CT); Series: ERJ; Part Status: Active; Value: 10k; Tolerance: ±1%; Composition: Thick Film; Features: Automotive AEC-Q200; Operating Temperature: -55°C ~ 155°C; Package / Case: 1206 (3216 Metric); Supplier Device Package: 1206; Size / Dimension: 0.126" L x 0.063" W (3.20mm x 1.60mm); Height - Seated (Max): 0.028" (0.70mm); Number of Terminations: 2; Failure Rate: -

## Sheet Gate Driver Rectifier.SchDoc
size A4
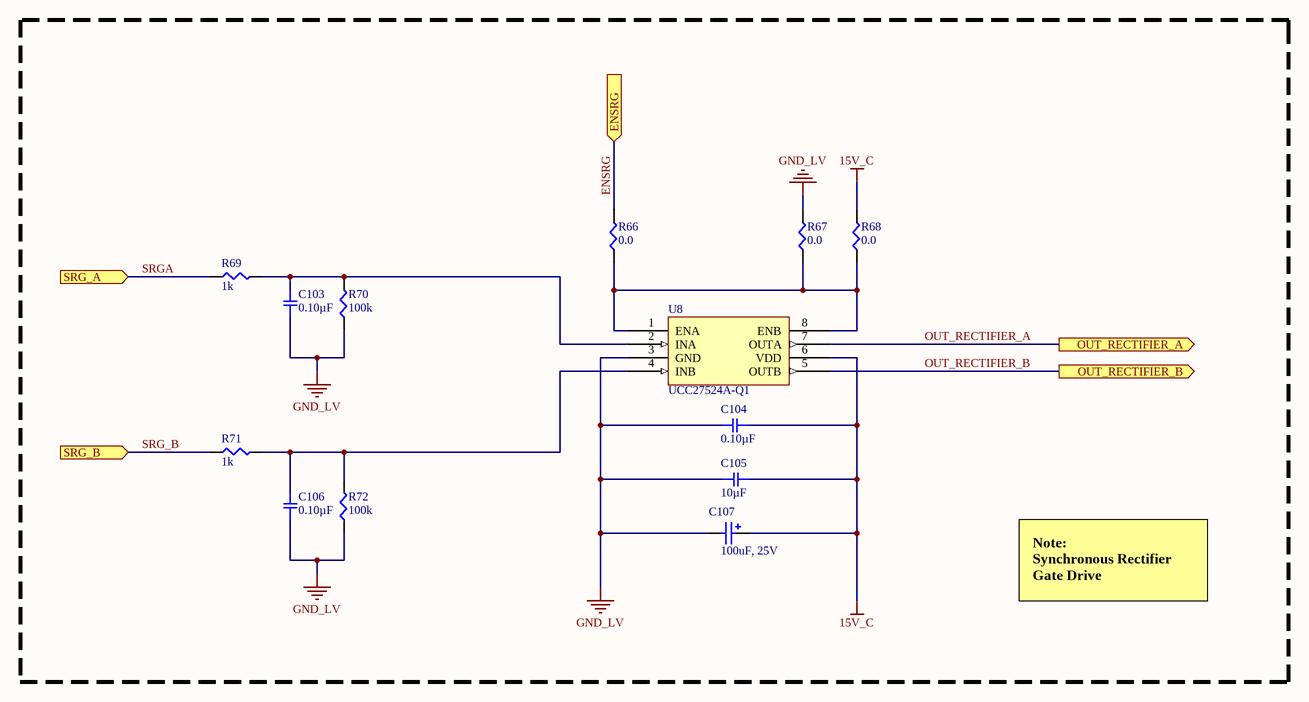
[diagram p16: Gate Driver Rectifier.SchDoc]

### Parts
(Parts that share a designator on the sheet are numbered #1, #2 ... from top to bottom, then left to right.)
C103#2  0.10µF  [SMD-0805C]
C104#2  0.10µF  [SMD-0805C]
C105#2  10µF  [SMD-0805C]
C106#2  0.10µF  [SMD-0805C]
C107#2  100uF, 25V  [WCAP-ASLL_6.3x7.7]
R66  0.0  [SMD-0603-RES]
R67  0.0  [SMD-0603-RES]
R68  0.0  [SMD-0603-RES]
R69  1k  [SMD-0603-RES]
R70  100k  [SMD-0603-RES]
R71  1k  [SMD-0603-RES]
R72  100k  [SMD-0603-RES]
U8  UCC27524A-Q1  [SOIC127P570X175_HS-9N]

### Ports
ENSRG (in), OUT_RECTIFIER_A (out), OUT_RECTIFIER_B (out), SRG_A (in), SRG_B (in)

### Nets
15V_C: C104#2.1 C105#2.2 C107#2.2(P) R68.2 U8.6(VDD)
GND_LV: C103#2.1 C104#2.2 C105#2.1 C106#2.1 C107#2.1(N) R67.2 R70.1 R72.1 U8.3(GND)
ENSRG: R66.2 ; port ENSRG
OUT_RECTIFIER_A: U8.7(OUTA) ; port OUT_RECTIFIER_A
OUT_RECTIFIER_B: U8.5(OUTB) ; port OUT_RECTIFIER_B
SRG_B: R71.1 ; port SRG_B
SRGA: R69.1 ; port SRG_A  [project net SRG_A]
NetC103#2_2: C103#2.2 R69.2 R70.2 U8.2(INA)
NetC106#2_2: C106#2.2 R71.2 R72.2 U8.4(INB)
NetR66_1: R66.1 R67.1 R68.1 U8.1(ENA) U8.8(ENB)

### Notes on the sheet
- Note:
  Synchronous Rectifier Gate Drive

### Library data of the parts
C103#2 C104#2 C106#2 = GCD21BR71H104KA01L: as C4 on sheet Input Sense Network; Datasheets: http://www.murata.com/~/media/webrenewal/support/library/catalog/products/capacitor/mlcc/c03e.ashx; Image: //media.digikey.com/Renders/Murata%20Renders/0805%28GxM6%29.jpg; Digi-Key Part Number: 490-11955-1-ND; Part Number: GCD21BR71H104KA01L; Quantity Available: 157; @ qty: 0; Packaging: Cut Tape (CT); Series: GCD; Part Status: Active; Value: 0.10µF; Voltage: 50V; Temperature Coefficient: X7R; Operating Temperature: -55°C ~ 125°C; Features: -; Ratings: AEC-Q200; Applications: Automotive; Mounting Type: Surface Mount, MLCC; Package / Case: 0805 (2012 Metric); Size / Dimension: 0.079" L x 0.049" W (2.00mm x 1.25mm); Height - Seated (Max): -; Thickness (Max): 0.049" (1.25mm); Lead Spacing: -; Lead Style: -
C105#2 = GRM21BC8YA106KE11L: CAP CER 10UF 35V X6S 0805; Manufacturer: Murata Electronics North America; Factory Stock: 0; Unit Price (USD): 0.33; Minimum Quantity: 1; Tolerance: ±10%; Datasheets: http://www.murata.com/~/media/webrenewal/support/library/catalog/products/capacitor/mlcc/c02e.pdf; Image: //media.digikey.com/Renders/Murata%20Renders/0805%20(2012%20Metric)%20.85mm.jpg; Digi-Key Part Number: 490-10504-1-ND; Part Number: GRM21BC8YA106KE11L; Quantity Available: 72253; @ qty: 0; Packaging: Cut Tape (CT); Series: GRM; Part Status: Active; Value: 10µF; Voltage: 35V; Temperature Coefficient: X6S; Operating Temperature: -55°C ~ 105°C; Features: Derating Recommended; Ratings: -; Applications: General Purpose; Mounting Type: Surface Mount, MLCC; Package / Case: 0805 (2012 Metric); Size / Dimension: 0.079" L x 0.049" W (2.00mm x 1.25mm); Height - Seated (Max): -; Thickness (Max): 0.057" (1.45mm); Lead Spacing: -; Lead Style: -
C107#2 = 865060445005: WCAP-ASLL SMT Aluminum Electrolytic Capacitors, D6.3mm x L7.7mm, 100uF, +/-20%, 25VDC; Dissipation Factor: 14%; Endurance: 2000h; Leakage Current: 25uA; Ripple Current max.: 300mA; Technical Reference: ASED077101M025DVCTCB000; ComponentLink1Description: Manufacturer; ComponentLink1URL: http://www.we-online.de; ComponentLink2Description: Datasheet; ComponentLink2URL: https://katalog.we-online.com/pbs/datasheet/865060445005.pdf; Length: 7.7mm; Mounting Technology: SMT; Operating Temperature: -55 to +105degC; Packaging: Tape and Reel; Published Date: August 2019; Capacitance: 100uF; Diameter: 6.3mm; Part Number: 865060445005; Publisher: Wurth Elektronik; Capacitance Tolerance: +/-20%; Rated Voltage: 25VDC
R66-R68 = ERJ-3GEY0R00V: as R147-R152 on sheet Input Current Sense; Part Number: ERJ-3GEY0R00V; Datasheets: http://industrial.panasonic.com/www-cgi/jvcr13pz.cgi?E+PZ+3+AOA0001+ERJ3GEY0R00V+7+WW; Image: //media.digikey.com/Photos/Panasonic%20Photos/MFG_ERJ-P6W%20Series.jpg; Digi-Key Part Number: P0.0GCT-ND; Quantity Available: 4813372; Packaging: Cut Tape (CT); Series: ERJ; Part Status: Active; Value: 0.0; Tolerance: Jumper; Composition: Thick Film; Features: Automotive AEC-Q200; Temperature Coefficient: -; Operating Temperature: -55°C ~ 155°C; Package / Case: 0603 (1608 Metric); Supplier Device Package: 0603; Size / Dimension: 0.063" L x 0.031" W (1.60mm x 0.80mm); Height - Seated (Max): 0.022" (0.55mm); Number of Terminations: 2; Failure Rate: -
R69 R71 = ERJ-3EKF1001V: as R160#2 on sheet Input Current Sense; Part Number: ERJ-3EKF1001V; Datasheets: http://industrial.panasonic.com/www-cgi/jvcr13pz.cgi?E+PZ+3+AOA0002+ERJ3EKF1001V+7+WW; Image: //media.digikey.com/Photos/Panasonic%20Photos/MFG_ERJ-P6W%20Series.jpg; Digi-Key Part Number: P1.00KHCT-ND; Quantity Available: 5218845; Packaging: Cut Tape (CT); Series: ERJ; Part Status: Active; Value: 1k; Tolerance: ±1%; Composition: Thick Film; Features: Automotive AEC-Q200; Operating Temperature: -55°C ~ 155°C; Package / Case: 0603 (1608 Metric); Supplier Device Package: 0603; Size / Dimension: 0.063" L x 0.031" W (1.60mm x 0.80mm); Height - Seated (Max): 0.022" (0.55mm); Number of Terminations: 2; Failure Rate: -
R70 R72 = ERJ-3EKF1003V: as R112 on sheet Input Voltage Sense; Part Number: ERJ-3EKF1003V; Datasheets: http://industrial.panasonic.com/www-cgi/jvcr13pz.cgi?E+PZ+3+AOA0002+ERJ3EKF1003V+7+WW; Image: //media.digikey.com/Photos/Panasonic%20Photos/MFG_ERJ-P6W%20Series.jpg; Digi-Key Part Number: P100KHCT-ND; Quantity Available: 2179804; Packaging: Cut Tape (CT); Series: ERJ; Part Status: Active; Value: 100k; Tolerance: ±1%; Composition: Thick Film; Features: Automotive AEC-Q200; Operating Temperature: -55°C ~ 155°C; Package / Case: 0603 (1608 Metric); Supplier Device Package: 0603; Size / Dimension: 0.063" L x 0.031" W (1.60mm x 0.80mm); Height - Seated (Max): 0.022" (0.55mm); Number of Terminations: 2; Failure Rate: -
U8 = UCC27524A